# EAGLE schematic weather (EAGLE 7.2.0)
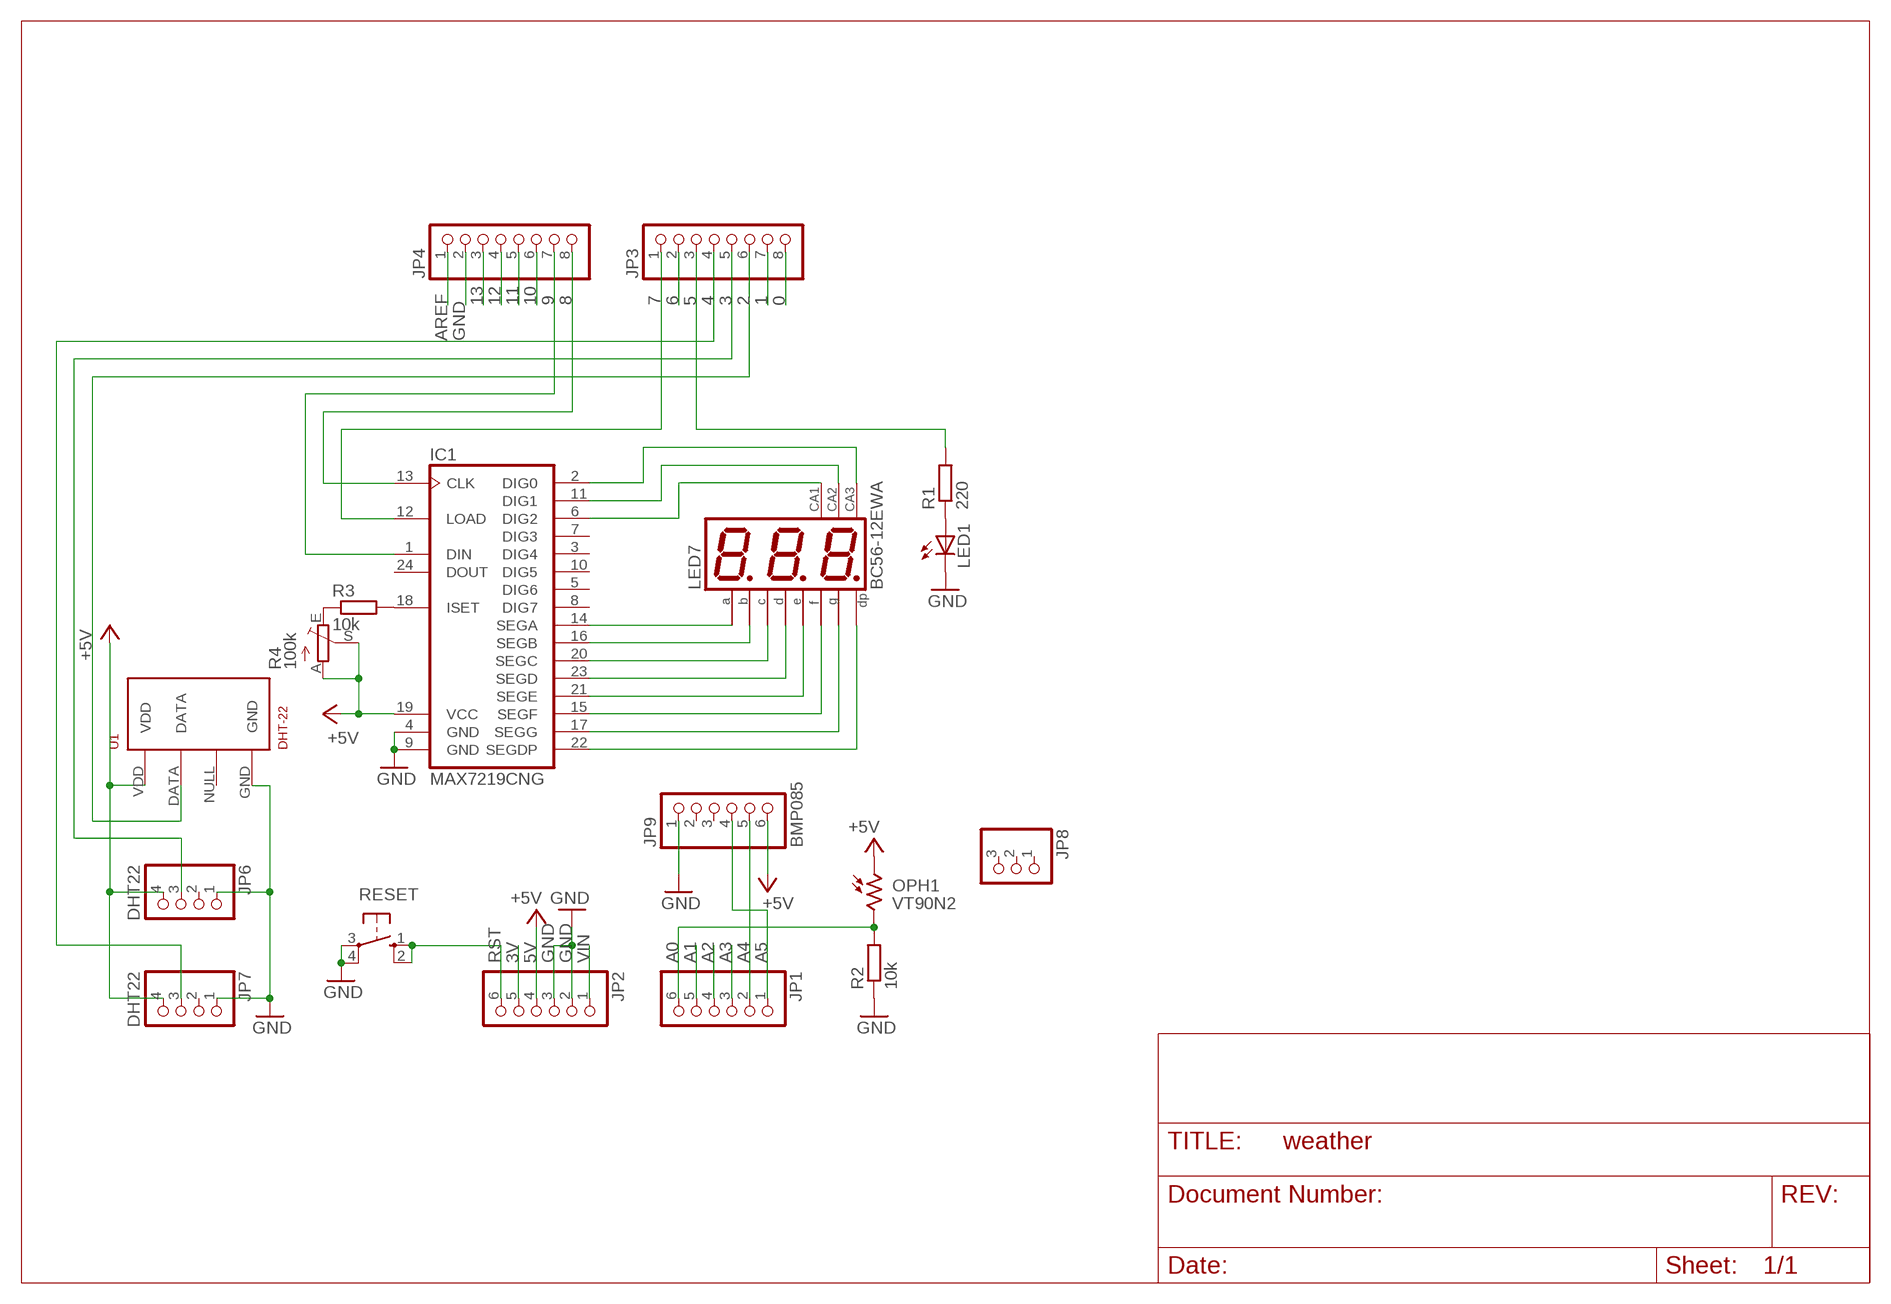
[diagram p0: schematic, sheet 1]

## Parts
IC1  MAX7219CNG  [DIL24-3]
JP1  PINHD-1X6  [1X06]
JP2  PINHD-1X6  [1X06]
JP3  PINHD-1X8  [1X08]
JP4  PINHD-1X8  [1X08]
JP6  DHT22  PINHD-1X4  [1X04]
JP7  DHT22  PINHD-1X4  [1X04]
JP8  PINHD-1X3  [1X03]
JP9  BMP085  PINHD-1X6  [1X06]
LED1  LED3MM  [LED3MM]
LED7  BC56-12EWA  [BX56-12]
OPH1  VT90N2  [VT900]
R1  220  R-EU_0207/2V  [0207/2V]
R2  10k  R-EU_0204/2V  [0204V]
R3  10k  R-EU_0204/2V  [0204V]
R4  100k  TRIM_EU-CA6V  [CA6V]
RESET  10-XX  [B3F-10XX]
U1  DHT-22  RHT03_DHT-22_AM2302  [RHT03_DHT-22]

## Nets
0: JP3.8
1: JP3.7
2: JP3.6 U1.DATA
3: JP3.5 JP6.3
3V: JP2.5
4: JP3.4 JP7.3
5: JP3.3 R1.2
5V: IC1.19(VCC) JP2.4 R4.A R4.S ; supply symbol labelled +5V
6: JP3.2
7: IC1.12(LOAD) JP3.1
8: IC1.13(CLK) JP4.8
9: IC1.1(DIN) JP4.7
10: JP4.6
11: JP4.5
12: JP4.4
13: JP4.3
+5V: JP6.4 JP7.4 JP9.6 OPH1.1
A0: JP1.6 OPH1.2 R2.2
A1: JP1.5
A2: JP1.4
A3: JP1.3
A4: JP1.2 JP9.5
A5: JP1.1 JP9.4
AREF: JP4.1
GND: IC1.4(GND) IC1.9(GND) JP2.2 JP2.3 JP4.2 JP6.1 JP7.1 JP9.1 LED1.K(C) R2.1 RESET.3(P) RESET.4(P1)
N$1: IC1.14(SEGA) LED7.11(A)
N$2: IC1.16(SEGB) LED7.7(B)
N$3: IC1.20(SEGC) LED7.4(C)
N$4: IC1.23(SEGD) LED7.2(D)
N$5: IC1.21(SEGE) LED7.1(E)
N$6: IC1.15(SEGF) LED7.10(F)
N$7: IC1.17(SEGG) LED7.5(G)
N$8: IC1.22(SEGDP) LED7.3(DP)
N$9: IC1.6(DIG2) LED7.12(CA)
N$10: IC1.11(DIG1) LED7.9(CA)
N$11: IC1.2(DIG0) LED7.8(CA)
N$13: IC1.18(ISET) R3.2
N$14: R3.1 R4.E
N$18: LED1.A R1.1
RST: JP2.6 RESET.1(S) RESET.2(S1)
VIN: JP2.1
Unconnected: IC1.3(DIG4) IC1.5(DIG6) IC1.7(DIG3) IC1.8(DIG7) IC1.10(DIG5) IC1.24(DOUT) JP6.2 JP7.2 JP8.1 JP8.2 JP8.3 JP9.2 JP9.3 U1.NULL

## Power pins joined to a net without a drawn wire
GND: U1.GND
VDD: U1.VDD

## Library data of the parts
IC1 = maxim:MAX7219CNG: LED DISPLAY DRIVER; MF: MAXIM; MPN: MAX7219CNG; OC_FARNELL: 1523914; OC_NEWARK: 34C4018
JP1 JP2 JP9 = pinhead:PINHD-1X6: PIN HEADER
JP3 JP4 = pinhead:PINHD-1X8: PIN HEADER
JP6 JP7 = pinhead:PINHD-1X4: PIN HEADER
JP8 = pinhead:PINHD-1X3: PIN HEADER
LED1 = led:LED: LED OSRAM: - CHIPLED LG R971, LG N971, LY N971, LG Q971, LY Q971, LO R971, LY R971 LH N974, LH R974 LS Q976, LO Q976, LY Q976 LO Q996 - Hyper CHIPLED LW Q18S LB Q993, LB Q99A, LB R99A - SideLED LS A670, LO A670, LY A670, LG A670, LP A670 LB A673, LV A673, LT A673, LW A673 LH A674 LY A675 LS A676, LA A676, LO A676, LY A676, LW A676 LS A679, LY A679, LG A679 - Hyper Micro SIDELED® LS Y876, LA Y876, LO Y876, LY Y876 LT Y87S - SmartLED LW L88C, LW L88S LB L89C, LB L89S, LG L890 LS L89K, LO L89K, LY L89K LS L896, LA L896, LO L896, LY L896 - TOPLED LS T670, LO T670, LY T670, LG T670, LP T670 LSG T670, LSP T670, LSY T670, LOP T670, LYG T670 LG T671, LOG T671, LSG T671 LB T673, LV T673, LT T673, LW T673 LH T674 LS T676, LA T676, LO T676, LY T676, LB T676, LH T676, LSB T676, LW T676 LB T67C, LV T67C, LT T67C, LS T67K, LO T67K, LY T67K, LW E67C LS E67B, LA E67B, LO E67B, LY E67B, LB E67C, LV E67C, LT E67C LW T67C LS T679, LY T679, LG T679 LS T770, LO T770, LY T770, LG T770, LP T770 LB T773, LV T773, LT T773, LW T773 LH T774 LS E675, LA E675, LY E675, LS T675 LS T776, LA T776, LO T776, LY T776, LB T776 LHGB T686 LT T68C, LB T68C - Hyper Mini TOPLED® LB M676 - Mini TOPLED Santana® LG M470 LS M47K, LO M47K, LY M47K Source: http://www.osram.convergy.de LUXEON: - LUMILED® LXK2-PW12-R00, LXK2-PW12-S00, LXK2-PW14-U00, LXK2-PW14-V00 LXK2-PM12-R00, LXK2-PM12-S00, LXK2-PM14-U00 LXK2-PE12-Q00, LXK2-PE12-R00, LXK2-PE12-S00, LXK2-PE14-T00, LXK2-PE14-U00 LXK2-PB12-K00, LXK2-PB12-L00, LXK2-PB12-M00, LXK2-PB14-N00, LXK2-PB14-P00, LXK2-PB14-Q00 LXK2-PR12-L00, LXK2-PR12-M00, LXK2-PR14-Q00, LXK2-PR14-R00 LXK2-PD12-Q00, LXK2-PD12-R00, LXK2-PD12-S00 LXK2-PH12-R00, LXK2-PH12-S00 LXK2-PL12-P00, LXK2-PL12-Q00, LXK2-PL12-R00 Source: www.luxeon.com KINGBRIGHT: KA-3528ASYC Source: www.kingbright.com
LED7 = display-kingbright:B?56-12*WA: 14.22mm (0.56INCH) THREE DIGIT NUMERIC DISPLAY Source: http://www.kingbright.com .. BA56-11EWA(Ver1189474895.pdf; OC_FARNELL: unknown; OC_NEWARK: unknown
OPH1 = photo-elements:VT9: Photoconductive Cell VT900 Series Source: http://optoelectronics.perkinelmer.com/content/Datasheets/DTS_vt900seriesdatasheet.pdf
R1-R3 = rcl:R-EU_: RESISTOR, European symbol
R4 = pot:TRIM_EU-: POTENTIOMETER
RESET = switch-omron:10-XX: OMRON SWITCH; MPN: B3F-1000; OC_FARNELL: 176432; OC_NEWARK: 36M3542
U1 = RHT03_DHT-22_AM2302:RHT03_DHT-22_AM2302: RHT03 / DHT-22 / AM2302 Packages and symbol for the RHT03 / DHT-22 relative humidity and temperature sensor. Note: The AM2302 is a wired version of the DHT-22 which typically requires less clearance and is thus provided as a separate package.; PROD_ID: SEN-10167